# EAGLE design mbV3 (EAGLE 5.10)
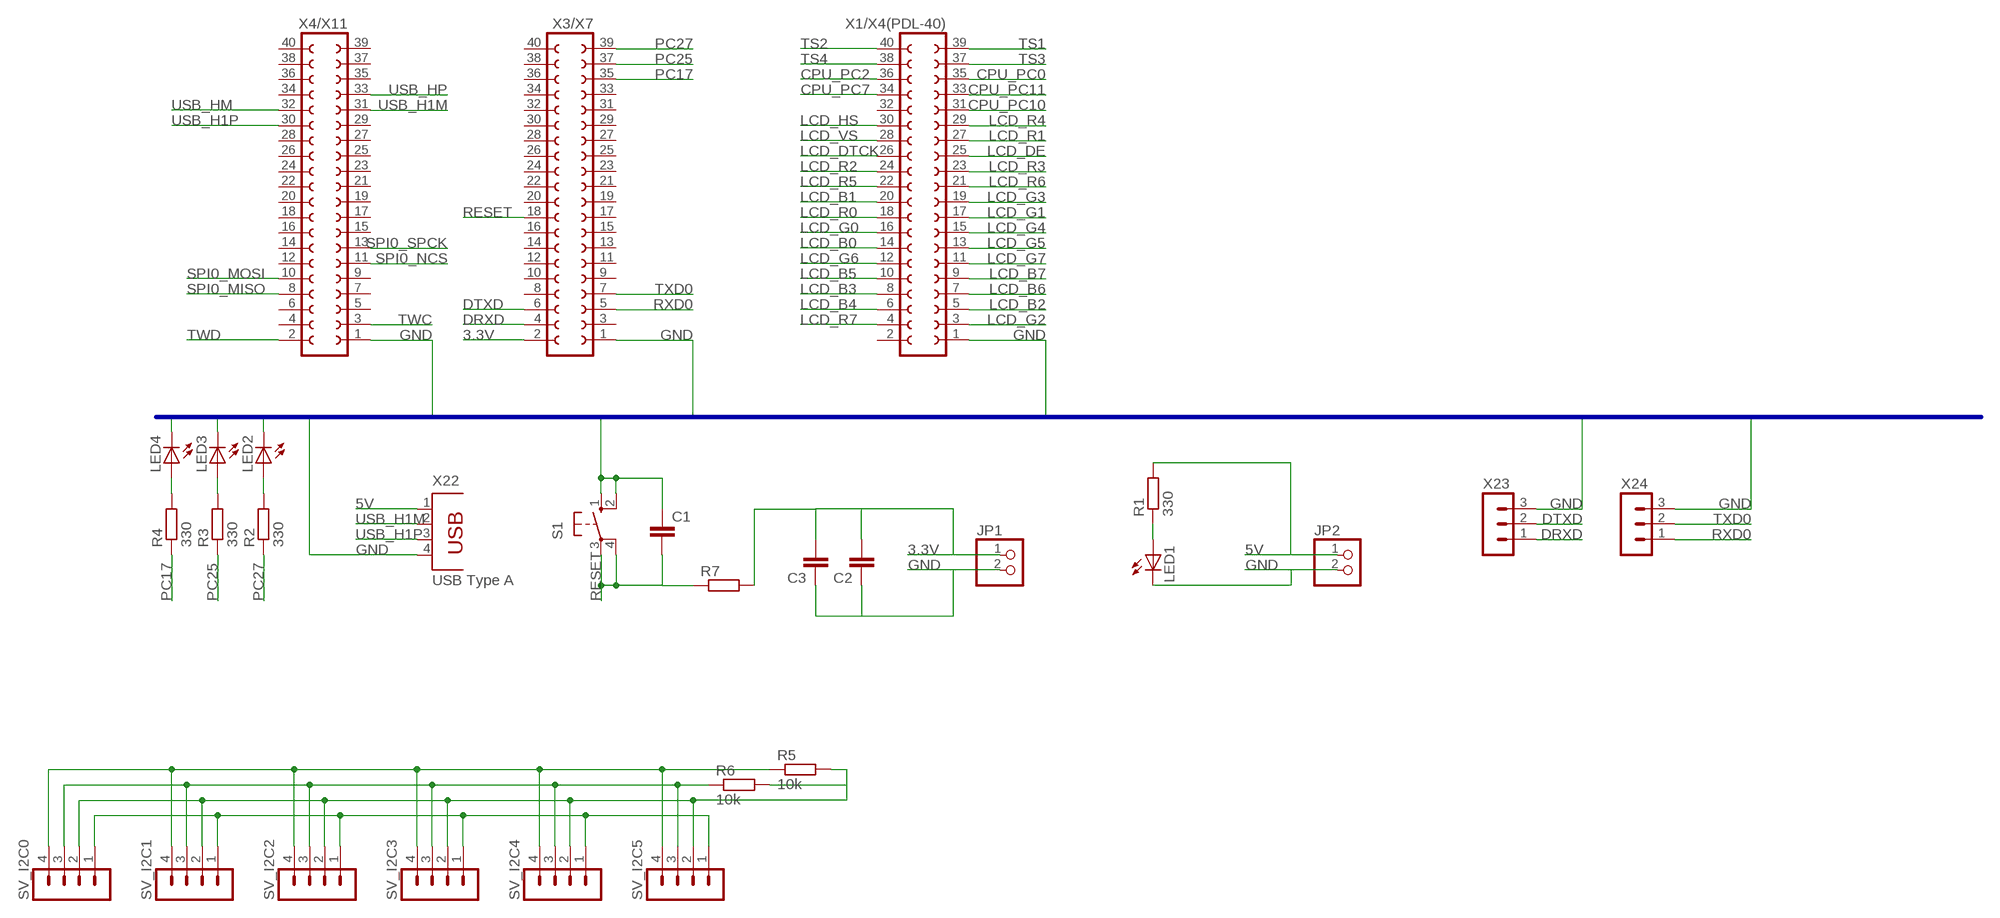
[diagram p0: schematic, sheet 1]

## Parts
C1  C-EUC0805  [C0805]
C2  C-EUC0805  [C0805]
C3  C-EUC0805  [C0805]
JP1  PINHD-1X2  [1X02]
JP2  PINHD-1X2  [1X02]
LED1  LED3MM  [LED3MM]
LED2  LED3MM  [LED3MM]
LED3  LED3MM  [LED3MM]
LED4  LED3MM  [LED3MM]
R1  330  R-EU_M1206  [M1206]
R2  330  R-EU_M1206  [M1206]
R3  330  R-EU_M1206  [M1206]
R4  330  R-EU_M1206  [M1206]
R5  10k  R-EU_R0805  [R0805]
R6  10k  R-EU_R0805  [R0805]
R7  R-EU_R0805  [R0805]
S1  10-XX  [B3F-10XX]
SV_I2C0  MA04-1  [MA04-1]
SV_I2C1  MA04-1  [MA04-1]
SV_I2C2  MA04-1  [MA04-1]
SV_I2C3  MA04-1  [MA04-1]
SV_I2C4  MA04-1  [MA04-1]
SV_I2C5  MA04-1  [MA04-1]
X1/X4(PDL-40)  FE20-2  [FE20-2]
X3/X7  FE20-2  [FE20-2]
X4/X11  FE20-2  [FE20-2]
X22  USB Type A  PN87520  [PN87520]
X23  MA03-1  [MA03-1]
X24  MA03-1  [MA03-1]

## Nets
3.3V: C2.2 C3.2 JP1.1 R5.2 R6.2 R7.2 SV_I2C0.2 SV_I2C1.2 SV_I2C2.2 SV_I2C3.2 SV_I2C4.2 SV_I2C5.2 X3/X7.2
5V: JP2.1 R1.2 X22.1
CPU_PC0: X1/X4(PDL-40).35
CPU_PC2: X1/X4(PDL-40).36
CPU_PC7: X1/X4(PDL-40).34
CPU_PC10: X1/X4(PDL-40).31
CPU_PC11: X1/X4(PDL-40).33
DRXD: X3/X7.4 X23.1
DTXD: X3/X7.6 X23.2
GND: C1.1 C2.1 C3.1 JP1.2 JP2.2 LED1.K(C) LED2.K(C) LED3.K(C) LED4.K(C) S1.1(S) S1.2(S1) SV_I2C0.1 SV_I2C1.1 SV_I2C2.1 SV_I2C3.1 SV_I2C4.1 SV_I2C5.1 X1/X4(PDL-40).1 X3/X7.1 X4/X11.1 X22.4 X23.3 X24.3
LCD_B0: X1/X4(PDL-40).14
LCD_B1: X1/X4(PDL-40).20
LCD_B2: X1/X4(PDL-40).5
LCD_B3: X1/X4(PDL-40).8
LCD_B4: X1/X4(PDL-40).6
LCD_B5: X1/X4(PDL-40).10
LCD_B6: X1/X4(PDL-40).7
LCD_B7: X1/X4(PDL-40).9
LCD_DE: X1/X4(PDL-40).25
LCD_DTCK: X1/X4(PDL-40).26
LCD_G0: X1/X4(PDL-40).16
LCD_G1: X1/X4(PDL-40).17
LCD_G2: X1/X4(PDL-40).3
LCD_G3: X1/X4(PDL-40).19
LCD_G4: X1/X4(PDL-40).15
LCD_G5: X1/X4(PDL-40).13
LCD_G6: X1/X4(PDL-40).12
LCD_G7: X1/X4(PDL-40).11
LCD_HS: X1/X4(PDL-40).30
LCD_R0: X1/X4(PDL-40).18
LCD_R1: X1/X4(PDL-40).27
LCD_R2: X1/X4(PDL-40).24
LCD_R3: X1/X4(PDL-40).23
LCD_R4: X1/X4(PDL-40).29
LCD_R5: X1/X4(PDL-40).22
LCD_R6: X1/X4(PDL-40).21
LCD_R7: X1/X4(PDL-40).4
LCD_VS: X1/X4(PDL-40).28
N$1: LED1.A R1.1
N$4: LED2.A R2.2
N$6: LED3.A R3.2
N$7: LED4.A R4.2
PC17: R4.1 X3/X7.35
PC25: R3.1 X3/X7.37
PC27: R2.1 X3/X7.39
RESET: C1.2 R7.1 S1.3(P) S1.4(P1) X3/X7.18
RXD0: X3/X7.5 X24.1
SPI0_MISO: X4/X11.8
SPI0_MOSI: X4/X11.10
SPI0_NCS: X4/X11.11
SPI0_SPCK: X4/X11.13
TS1: X1/X4(PDL-40).39
TS2: X1/X4(PDL-40).40
TS3: X1/X4(PDL-40).37
TS4: X1/X4(PDL-40).38
TWC: R6.1 SV_I2C0.3 SV_I2C1.3 SV_I2C2.3 SV_I2C3.3 SV_I2C4.3 SV_I2C5.3 X4/X11.3
TWD: R5.1 SV_I2C0.4 SV_I2C1.4 SV_I2C2.4 SV_I2C3.4 SV_I2C4.4 SV_I2C5.4 X4/X11.2
TXD0: X3/X7.7 X24.2
USB_H1M: X4/X11.31 X22.2
USB_H1P: X4/X11.30 X22.3
USB_HM: X4/X11.32
USB_HP: X4/X11.33
Unconnected: X1/X4(PDL-40).2 X1/X4(PDL-40).32 X3/X7.3 X3/X7.8 X3/X7.9 X3/X7.10 X3/X7.11 X3/X7.12 X3/X7.13 X3/X7.14 X3/X7.15 X3/X7.16 X3/X7.17 X3/X7.19 X3/X7.20 X3/X7.21 X3/X7.22 X3/X7.23 X3/X7.24 X3/X7.25 X3/X7.26 X3/X7.27 X3/X7.28 X3/X7.29 X3/X7.30 X3/X7.31 X3/X7.32 X3/X7.33 X3/X7.34 X3/X7.36 X3/X7.38 X3/X7.40 X4/X11.4 X4/X11.5 X4/X11.6 X4/X11.7 X4/X11.9 X4/X11.12 X4/X11.14 X4/X11.15 X4/X11.16 X4/X11.17 X4/X11.18 X4/X11.19 X4/X11.20 X4/X11.21 X4/X11.22 X4/X11.23 X4/X11.24 X4/X11.25 X4/X11.26 X4/X11.27 X4/X11.28 X4/X11.29 X4/X11.34 X4/X11.35 X4/X11.36 X4/X11.37 X4/X11.38 X4/X11.39 X4/X11.40

## Buses
GND

## Library data of the parts
C1-C3 = resistor:C-EU: CAPACITOR, European symbol
JP1 JP2 = pinhead:PINHD-1X2: PIN HEADER
LED1-LED4 = led:LED: LED OSRAM: - CHIPLED LG R971, LG N971, LY N971, LG Q971, LY Q971, LO R971, LY R971 LH N974, LH R974 LS Q976, LO Q976, LY Q976 LO Q996 - Hyper CHIPLED LW Q18S LB Q993, LB Q99A, LB R99A - SideLED LS A670, LO A670, LY A670, LG A670, LP A670 LB A673, LV A673, LT A673, LW A673 LH A674 LY A675 LS A676, LA A676, LO A676, LY A676, LW A676 LS A679, LY A679, LG A679 - Hyper Micro SIDELED® LS Y876, LA Y876, LO Y876, LY Y876 LT Y87S - SmartLED LW L88C, LW L88S LB L89C, LB L89S, LG L890 LS L89K, LO L89K, LY L89K LS L896, LA L896, LO L896, LY L896 - TOPLED LS T670, LO T670, LY T670, LG T670, LP T670 LSG T670, LSP T670, LSY T670, LOP T670, LYG T670 LG T671, LOG T671, LSG T671 LB T673, LV T673, LT T673, LW T673 LH T674 LS T676, LA T676, LO T676, LY T676, LB T676, LH T676, LSB T676, LW T676 LB T67C, LV T67C, LT T67C, LS T67K, LO T67K, LY T67K, LW E67C LS E67B, LA E67B, LO E67B, LY E67B, LB E67C, LV E67C, LT E67C LW T67C LS T679, LY T679, LG T679 LS T770, LO T770, LY T770, LG T770, LP T770 LB T773, LV T773, LT T773, LW T773 LH T774 LS E675, LA E675, LY E675, LS T675 LS T776, LA T776, LO T776, LY T776, LB T776 LHGB T686 LT T68C, LB T68C - Hyper Mini TOPLED® LB M676 - Mini TOPLED Santana® LG M470 LS M47K, LO M47K, LY M47K Source: http://www.osram.convergy.de LUXEON: - LUMILED® LXK2-PW12-R00, LXK2-PW12-S00, LXK2-PW14-U00, LXK2-PW14-V00 LXK2-PM12-R00, LXK2-PM12-S00, LXK2-PM14-U00 LXK2-PE12-Q00, LXK2-PE12-R00, LXK2-PE12-S00, LXK2-PE14-T00, LXK2-PE14-U00 LXK2-PB12-K00, LXK2-PB12-L00, LXK2-PB12-M00, LXK2-PB14-N00, LXK2-PB14-P00, LXK2-PB14-Q00 LXK2-PR12-L00, LXK2-PR12-M00, LXK2-PR14-Q00, LXK2-PR14-R00 LXK2-PD12-Q00, LXK2-PD12-R00, LXK2-PD12-S00 LXK2-PH12-R00, LXK2-PH12-S00 LXK2-PL12-P00, LXK2-PL12-Q00, LXK2-PL12-R00 Source: www.luxeon.com KINGBRIGHT: KA-3528ASYC Source: www.kingbright.com
R1-R7 = resistor:R-EU_: RESISTOR, European symbol
S1 = switch-omron:10-XX: OMRON SWITCH
SV_I2C0 SV_I2C1-SV_I2C5 = con-lstb:MA04-1: PIN HEADER
X1/X4(PDL-40) X3/X7 X4/X11 = con-lsta:FE20-2: FEMALE HEADER
X22 = con-berg:PN87520: BERG USB connector
X23 X24 = con-lstb:MA03-1: PIN HEADER

## Board
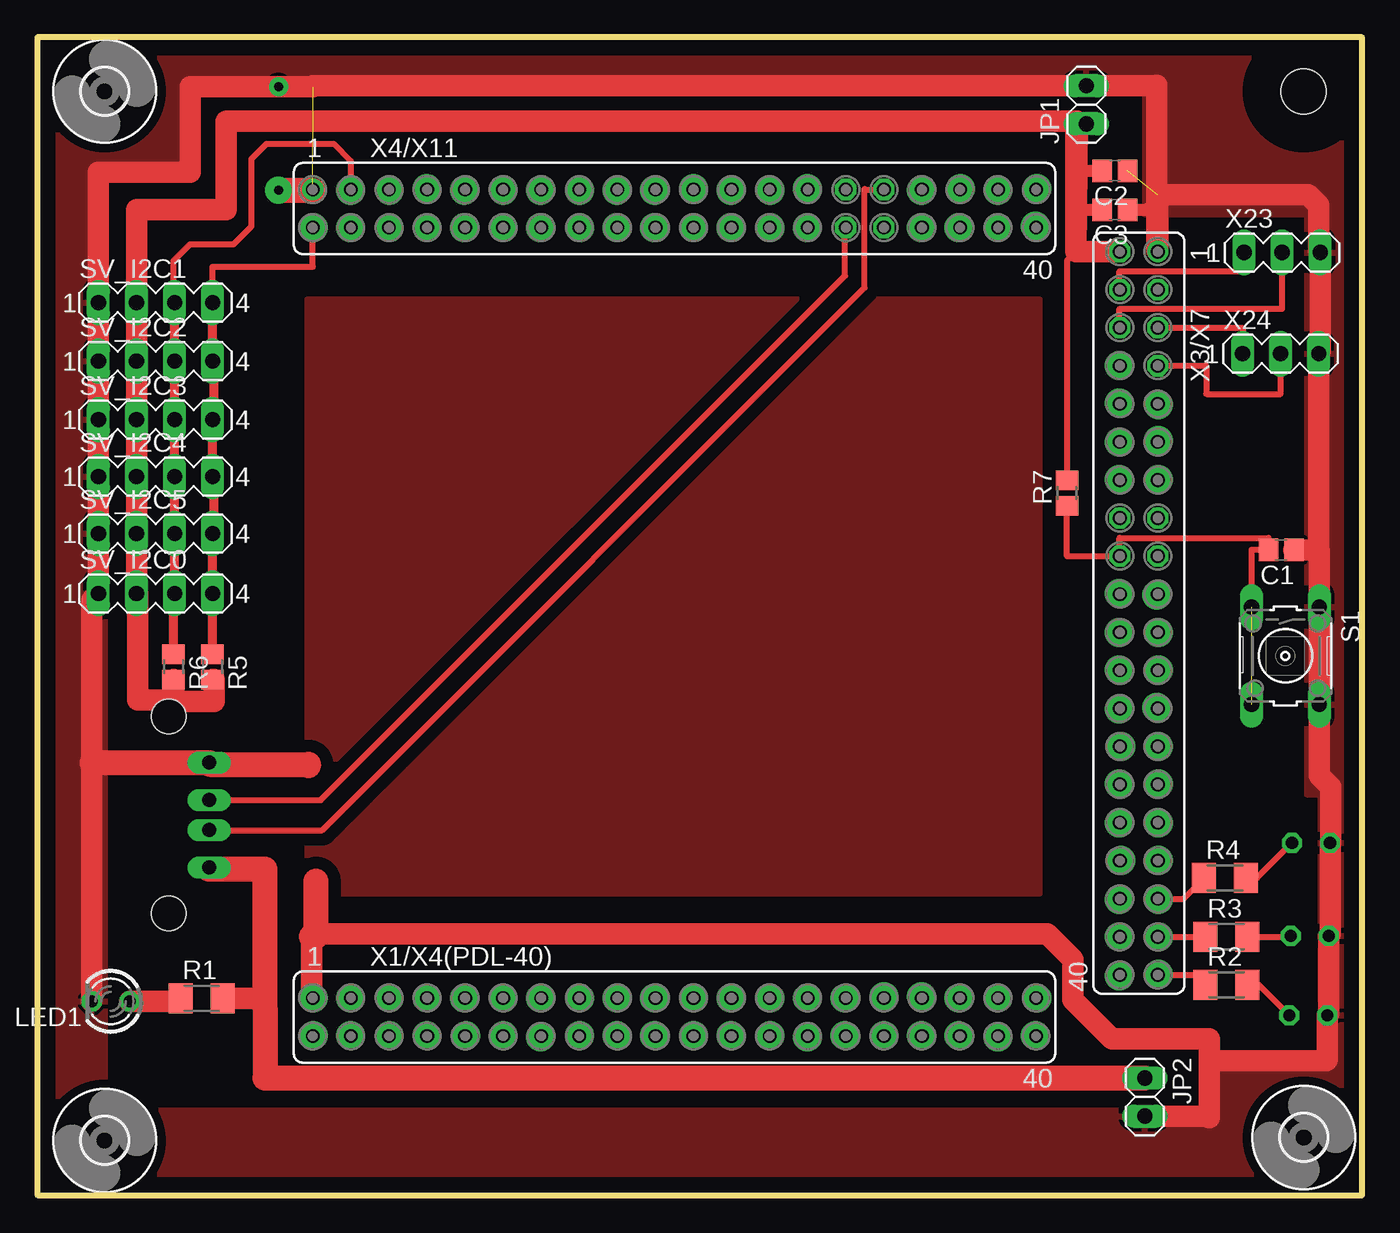
[diagram p1: board, top side]
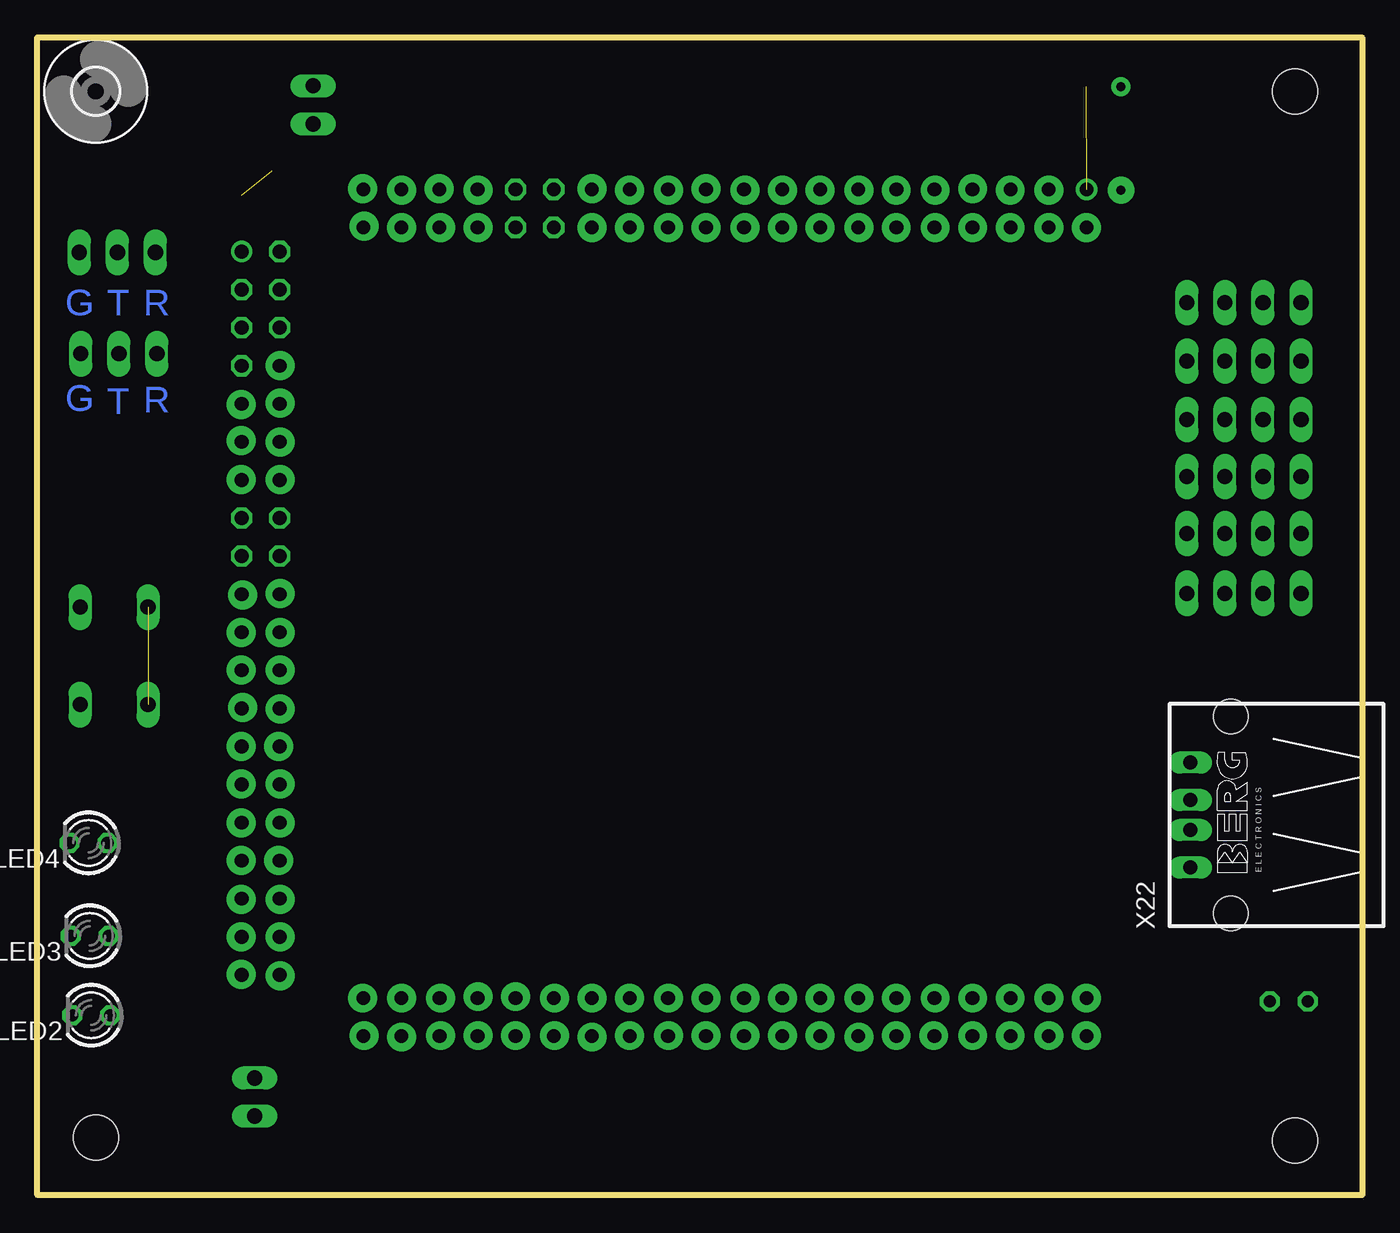
[diagram p2: board, bottom side, seen from below]

Size 88.37 x 77.24 mm. Coordinates in mm from the lower left corner, seen from the top.
Outline: 0,0 88.37,0 88.37,77.24 0,77.24 0,0
Copper layers (1*16): Top 0.035mm / dielectric 1.5mm / Bottom 0.035mm
Design rules "default *": minimum track width 12mil, minimum drill 32mil, track to track 12mil, track to pad 12mil, pad to pad 12mil, via to via 12mil, smd to smd 12mil, copper to edge 40mil, drill to drill 40mil, minimum pad ring 10mil, minimum via ring 8mil, stop-mask expansion 4mil, vias tented up to drill 0mil, thermal gap 10mil

### Footprints (pad centres in the part's own frame; a part is rotated, then mirrored left to right if it is on the bottom)
C0805 = smd 1.3 x 1.5: 1 -0.85,0; 2 0.85,0
1X02 = drill 1.016 long: 1 -1.27,0; 2 1.27,0
LED3MM = drill 0.813 octagon: A -1.27,0; K 1.27,0
M1206 = smd 1.6 x 2: 1 -1.4,0; 2 1.4,0
R0805 = smd 1.3 x 1.5: 1 -0.85,0; 2 0.85,0
B3F-10XX = drill 1.016 long: 1 -3.251,2.261; 2 3.251,2.261; 3 -3.251,-2.261; 4 3.251,-2.261
MA04-1 = drill 1.016 long: 1 -3.81,0; 2 -1.27,0; 3 1.27,0; 4 3.81,0
3,0 = hole 3: 0,0
FE20-2 = drill 0.914 round: 1 -24.13,1.27 | drill 0.914 octagon: 2 -24.13,-1.27; 3 -21.59,1.27; 4 -21.59,-1.27; 5 -19.05,1.27; 6 -19.05,-1.27; 7 -16.51,1.27; 8 -16.51,-1.27; 9 -13.97,1.27; 10 -13.97,-1.27; 11 -11.43,1.27; 12 -11.43,-1.27; 13 -8.89,1.27; 14 -8.89,-1.27; 15 -6.35,1.27; 16 -6.35,-1.27; 17 -3.81,1.27; 18 -3.81,-1.27; 19 -1.27,1.27; 20 -1.27,-1.27; 21 1.27,1.27; 22 1.27,-1.27; 23 3.81,1.27; 24 3.81,-1.27; 25 6.35,1.27; 26 6.35,-1.27; 27 8.89,1.27; 28 8.89,-1.27; 29 11.43,1.27; 30 11.43,-1.27; 31 13.97,1.27; 32 13.97,-1.27; 33 16.51,1.27; 34 16.51,-1.27; 35 19.05,1.27; 36 19.05,-1.27; 37 21.59,1.27; 38 21.59,-1.27; 39 24.13,1.27; 40 24.13,-1.27
PN87520 = drill 0.95 long: 1 -3.5,2.71; 2 -1,2.71; 3 1,2.71; 4 3.5,2.71 | hole 2.3: -6.57,0; 6.57,0
MA03-1 = drill 1.016 long: 1 -2.54,0; 2 0,0; 3 2.54,0

### Placement (x,y rotation side)
C1  82.98,43.05 180 top
C2  71.88,68.35 180 top
C3  71.88,65.75 180 top
JP1  69.98,72.75 90 top
JP2  73.88,6.55 270 top
LED1  4.88,12.93 180 top
LED2  84.78,12 180 bottom
LED3  84.88,17.3 180 bottom
LED4  84.97,23.5 180 bottom
R1  10.95,13.14 0 top
R2  79.33,14.04 0 top
R3  79.33,17.25 0 top
R4  79.23,21.16 0 top
R5  11.68,35.25 270 top
R6  9.08,35.25 270 top
R7  68.68,46.85 90 top
S1  83.25,35.98 270 top
SV_I2C0  7.88,40.15 0 top
SV_I2C1  7.88,59.55 0 top
SV_I2C2  7.88,55.65 0 top
SV_I2C3  7.88,51.75 0 top
SV_I2C4  7.88,47.95 0 top
SV_I2C5  7.88,44.15 0 top
U$1  [3,0]  4.48,3.65 0 top
U$2  [3,0]  84.48,3.85 0 top
U$3  [3,0]  4.48,73.65 0 top
U$4  [3,0]  84.48,73.65 0 bottom
X1/X4(PDL-40)  42.5,11.89 0 top
X3/X7  73.48,38.83 270 top
X4/X11  42.5,65.83 0 top
X22  8.74,25.37 90 bottom
X23  83.04,62.9 0 top
X24  82.94,56.14 0 top

### Tracks (layer width: path | path; a pad name or v marks a point on that pad's centre or on a via)
3.3V
  Top 0.406: R7.2 68.68,62.36 69.28,62.96
  Top 0.813: C2.2 69.45,68.35 69.34,68.46 | C3.2 69.32,65.75 69.31,65.76
  Top 1.422: JP1.1 69.28,71.48 69.28,62.96 | 69.28,62.96 69.28,62.95 X3/X7.2 69.28,62.96 | 69.28,62.96 69.31,65.76 69.34,68.46 69.38,71.65 12.58,71.65 12.58,65.75 6.61,65.75 SV_I2C1.2 SV_I2C2.2 SV_I2C3.2 SV_I2C4.2 SV_I2C5.2 SV_I2C0.2 6.68,40.15 6.68,33.05 9.08,33.05 | 9.08,33.05 R6.2 | R5.2 11.78,34.4 11.78,32.95 9.08,32.95 9.08,33.05
5V
  Top 1.422: 11.46,21.75 X22.1 | R1.2 14.58,13.14 15.18,12.55
  Top 1.676: JP2.1 15.18,7.82 15.18,12.55 15.18,21.75 11.46,21.75
DRXD
  Top 0.406: X3/X7.4 72.18,60.42 72.18,61.65 80.5,61.65 X23.1
DTXD
  Top 0.406: X3/X7.6 72.18,57.88 72.18,59.15 83.04,59.15 X23.2
GND  (2 unrouted)
  Top 0.813: C3.1 73.98,65.75 74.08,65.85
  Top 1.422: 18.37,74.02 JP1.2 74.65,74.02 74.68,74.05 74.68,63.03 X3/X7.1 74.75,66.72 74.78,66.75 84.78,66.75 85.48,66.05 85.48,63 X23.3 85.58,56.24 X24.3 85.48,43.05 | X4/X11.1 | 18.38,73.95 10.18,73.95 10.18,68.25 4.07,68.25 SV_I2C1.1 SV_I2C2.1 SV_I2C3.1 SV_I2C4.1 SV_I2C5.1 SV_I2C0.1 3.61,39.7 3.61,28.85 | 85.48,43.05 C1.1 | 85.48,43.05 85.52,43.01 S1.1 S1.2 85.52,28.01 86.28,27.25 86.28,23.55 LED4.K 86.23,17.39 LED3.K 86.15,12.09 LED2.K 86.06,9.03 85.98,8.95 78.18,8.95 | JP2.2 78.05,5.28 78.18,5.15 78.18,8.95 | 78.18,8.95 78.18,10.45 71.68,10.45 69.08,13.05 69.08,15.75 67.38,17.45 18.38,17.45 18.28,17.35 18.28,17.25 18.28,13.25 X1/X4(PDL-40).1 | LED1.K 3.61,28.85 | 3.61,28.85 3.63,28.87
  Top 1.676: 3.63,28.87 X22.4 | 18.28,17.25 18.58,17.25 18.58,20.95
  pour Top: 0.28,77.05 4.48,77.05 4.48,-0.05 0.28,-0.05
  pour Top: 0.28,77.05 0.28,69.15 9.48,69.15 9.48,73.55 88.28,73.55 88.28,77.15 0.28,77.15
  pour Top: 88.28,77.15 73.88,77.15 73.88,65.45 84.68,65.45 84.68,26.75 85.58,26.75 85.58,-0.05 88.28,-0.05
  pour Top: 88.38,0.35 4.58,0.35 4.58,5.65 88.38,5.65
  pour Top: 78.68,9.05 88.38,9.05 88.38,-0.05 78.68,-0.05
GND1
  pour Top (isolate 0.813): 17.98,20.15 66.88,20.15 66.88,59.75 17.98,59.75
N$1
  Top 1.422: LED1.A 9.34,12.93 R1.1
N$2  (via drill 0.6 pad 1.78)
  Top 1.676: v16.08,67.05 18.38,67.05
N$3  (via drill 0.6 pad 1.93)
  other vias: 18.38,64.55
N$4
  Top 0.406: R2.2 81.48,14.04 LED2.A
N$5  (via drill 0.6 pad 1.27)
  other vias: 16.08,73.95
N$6
  Top 0.406: R3.2 83.56,17.25 LED3.A
N$7
  Top 0.406: R4.2 81.35,21.16 LED4.A
N$8  (via drill 0.6 pad 1.93)
  other vias: 20.88,64.55
N$9
  Top 1.676: 11.48,28.75 18.08,28.75 18.08,28.65
N$10  (via drill 0.6 pad 1.93)
  other vias: 23.48,64.55
N$11  (via drill 0.6 pad 1.93)
  other vias: 25.98,64.55
N$12  (via drill 0.6 pad 1.93)
  other vias: 20.88,67.05
N$13  (via drill 0.6 pad 1.93)
  other vias: 23.48,67.05
N$14  (via drill 0.6 pad 1.93)
  other vias: 25.98,67.15
N$15  (via drill 0.6 pad 1.93)
  other vias: 28.48,67.05
N$16  (via drill 0.6 pad 1.93)
  other vias: 28.48,64.55
N$17  (via drill 0.6 pad 1.93)
  other vias: 31.08,64.55
N$18  (via drill 0.6 pad 1.93)
  other vias: 31.08,67.05
N$19  (via drill 0.6 pad 1.93)
  other vias: 33.58,67.05
N$20  (via drill 0.6 pad 1.93)
  other vias: 33.58,64.55
N$21  (via drill 0.6 pad 1.93)
  other vias: 36.18,64.55
N$22  (via drill 0.6 pad 1.93)
  other vias: 36.18,67.05
N$23  (via drill 0.6 pad 1.93)
  other vias: 38.68,64.55
N$24  (via drill 0.6 pad 1.93)
  other vias: 38.68,67.05
N$25  (via drill 0.6 pad 1.93)
  other vias: 41.18,67.05
N$26  (via drill 0.6 pad 1.93)
  other vias: 41.18,64.55
N$27  (via drill 0.6 pad 1.93)
  other vias: 43.78,67.15
N$28  (via drill 0.6 pad 1.93)
  other vias: 43.78,64.55
N$29  (via drill 0.6 pad 1.93)
  other vias: 46.28,64.55
N$30  (via drill 0.6 pad 1.93)
  other vias: 46.28,67.05
N$31  (via drill 0.6 pad 1.93)
  other vias: 48.88,67.05
N$32  (via drill 0.6 pad 1.93)
  other vias: 48.88,64.55
N$33  (via drill 0.6 pad 1.93)
  other vias: 51.38,64.55
N$34  (via drill 0.6 pad 1.93)
  other vias: 51.38,67.15
N$35  (via drill 0.6 pad 1.93)
  other vias: 58.98,67.05
N$36  (via drill 0.6 pad 1.93)
  other vias: 58.98,64.55
N$37  (via drill 0.6 pad 1.93)
  other vias: 61.58,67.15
N$38  (via drill 0.6 pad 1.93)
  other vias: 61.48,64.55
N$39  (via drill 0.6 pad 1.93)
  other vias: 64.08,64.55
N$40  (via drill 0.6 pad 1.93)
  other vias: 64.08,67.05
N$41  (via drill 0.6 pad 1.93)
  other vias: 66.68,67.15
N$42  (via drill 0.6 pad 1.93)
  other vias: 66.58,64.65
N$43  (via drill 0.6 pad 1.93)
  other vias: 72.18,55.35
N$44  (via drill 0.6 pad 1.93)
  other vias: 72.18,52.85
N$45  (via drill 0.6 pad 1.93)
  other vias: 74.78,52.75
N$46  (via drill 0.6 pad 1.93)
  other vias: 74.78,50.35
N$47  (via drill 0.6 pad 1.93)
  other vias: 72.18,50.25
N$48  (via drill 0.6 pad 1.93)
  other vias: 72.18,47.75
N$49  (via drill 0.6 pad 1.93)
  other vias: 74.78,47.75
N$50  (via drill 0.6 pad 1.93)
  other vias: 74.68,40.05
N$51  (via drill 0.6 pad 1.93)
  other vias: 72.18,40.15
N$52  (via drill 0.6 pad 1.93)
  other vias: 72.18,37.55
N$53  (via drill 0.6 pad 1.93)
  other vias: 74.78,37.55
N$54  (via drill 0.6 pad 1.93)
  other vias: 72.18,35.05
N$55  (via drill 0.6 pad 1.93)
  other vias: 74.78,35.05
N$56  (via drill 0.6 pad 1.93)
  other vias: 72.18,32.45
N$57  (via drill 0.6 pad 1.93)
  other vias: 74.68,32.55
N$58  (via drill 0.6 pad 1.93)
  other vias: 74.78,29.95
N$59  (via drill 0.6 pad 1.93)
  other vias: 72.28,29.95
N$60  (via drill 0.6 pad 1.93)
  other vias: 72.18,27.45
N$61  (via drill 0.6 pad 1.93)
  other vias: 74.78,27.45
N$62  (via drill 0.6 pad 1.93)
  other vias: 74.78,24.85
N$63  (via drill 0.6 pad 1.93)
  other vias: 72.18,24.85
N$64  (via drill 0.6 pad 1.93)
  other vias: 74.78,22.35
N$65  (via drill 0.6 pad 1.93)
  other vias: 72.28,22.35
N$66  (via drill 0.6 pad 1.93)
  other vias: 72.18,19.75
N$67  (via drill 0.6 pad 1.93)
  other vias: 74.78,19.75
N$68  (via drill 0.6 pad 1.93)
  other vias: 72.18,17.25
N$69  (via drill 0.6 pad 1.93)
  other vias: 74.78,17.25
N$70  (via drill 0.6 pad 1.93)
  other vias: 72.18,14.65
N$71  (via drill 0.6 pad 1.93)
  other vias: 74.78,14.75
N$72  (via drill 0.6 pad 1.93)
  other vias: 66.68,13.15
N$73  (via drill 0.6 pad 1.93)
  other vias: 66.58,10.65
N$74  (via drill 0.6 pad 1.93)
  other vias: 64.08,10.55
N$75  (via drill 0.6 pad 1.93)
  other vias: 64.08,13.15
N$76  (via drill 0.6 pad 1.93)
  other vias: 61.48,10.65
N$77  (via drill 0.6 pad 1.93)
  other vias: 61.48,13.15
N$78  (via drill 0.6 pad 1.93)
  other vias: 58.98,13.25
N$79  (via drill 0.6 pad 1.93)
  other vias: 58.98,10.65
N$80  (via drill 0.6 pad 1.93)
  other vias: 56.48,13.25
N$81  (via drill 0.6 pad 1.93)
  other vias: 56.48,10.65
N$82  (via drill 0.6 pad 1.93)
  other vias: 53.88,10.65
N$83  (via drill 0.6 pad 1.93)
  other vias: 53.88,13.15
N$84  (via drill 0.6 pad 1.93)
  other vias: 51.38,13.15
N$85  (via drill 0.6 pad 1.93)
  other vias: 51.38,10.55
N$86  (via drill 0.6 pad 1.93)
  other vias: 48.88,13.15
N$87  (via drill 0.6 pad 1.93)
  other vias: 48.88,10.65
N$88  (via drill 0.6 pad 1.93)
  other vias: 46.28,10.65
N$89  (via drill 0.6 pad 1.93)
  other vias: 46.28,13.15
N$90  (via drill 0.6 pad 1.93)
  other vias: 43.78,13.15
N$91  (via drill 0.6 pad 1.93)
  other vias: 43.78,10.65
N$92  (via drill 0.6 pad 1.93)
  other vias: 41.18,13.15
N$93  (via drill 0.6 pad 1.93)
  other vias: 41.18,10.65
N$94  (via drill 0.6 pad 1.93)
  other vias: 38.68,10.65
N$95  (via drill 0.6 pad 1.93)
  other vias: 38.68,13.15
N$96  (via drill 0.6 pad 1.93)
  other vias: 36.18,13.15
N$97  (via drill 0.6 pad 1.93)
  other vias: 36.18,10.65
N$98  (via drill 0.6 pad 1.93)
  other vias: 33.58,13.15
N$99  (via drill 0.6 pad 1.93)
  other vias: 33.58,10.55
N$100  (via drill 0.6 pad 1.93)
  other vias: 31.08,13.15
N$101  (via drill 0.6 pad 1.93)
  other vias: 31.08,10.65
N$102  (via drill 0.6 pad 1.93)
  other vias: 28.48,13.15
N$103  (via drill 0.6 pad 1.93)
  other vias: 28.58,10.65
N$104  (via drill 0.6 pad 1.93)
  other vias: 25.98,10.65
N$105  (via drill 0.6 pad 1.93)
  other vias: 25.98,13.15
N$106  (via drill 0.6 pad 1.93)
  other vias: 23.48,13.15
N$107  (via drill 0.6 pad 1.93)
  other vias: 23.48,10.65
N$108  (via drill 0.6 pad 1.93)
  other vias: 18.38,13.15
N$109  (via drill 0.6 pad 1.93)
  other vias: 18.38,10.65
N$110  (via drill 0.6 pad 1.93)
  other vias: 20.88,13.15
N$111  (via drill 0.6 pad 1.93)
  other vias: 20.88,10.65
N$112  (via drill 0.6 pad 1.93)
  other vias: 4.48,73.65
N$113  (via drill 0.6 pad 1.93)
  other vias: 84.48,73.65
N$114  (via drill 0.6 pad 1.93)
  other vias: 84.48,3.85
N$115  (via drill 0.6 pad 1.93)
  other vias: 4.48,3.65
PC17
  Top 0.406: X3/X7.35 76.45,19.78 R4.1
PC25
  Top 0.406: X3/X7.37 77.92,17.24 R3.1
PC27
  Top 0.406: X3/X7.39 77.27,14.7 R2.1
RESET  (1 unrouted)
  Top 0.406: 72.18,42.64 X3/X7.18 | 72.18,42.64 72.18,43.85 82.13,43.85 C1.2 80.99,43.05 S1.3 | 72.18,42.64 68.68,42.64 R7.1
RXD0
  Top 0.406: X3/X7.5 80.4,57.88 X24.1
TWC
  Top 0.406: X4/X11.3 20.91,69.02 19.78,70.15 15.28,70.15 14.28,69.15 14.28,64.65 13.08,63.45 10.18,63.45 9.08,62.35 9.08,59.62 SV_I2C1.3
  Top 0.61: SV_I2C1.3 SV_I2C2.3 SV_I2C3.3 SV_I2C4.3 SV_I2C5.3 SV_I2C0.3 9.08,40.08 R6.1
  Top 1.422: SV_I2C0.3 9.08,40.15
TWD
  Top 0.406: X4/X11.2 18.37,61.96 18.38,61.95 11.68,61.95 SV_I2C1.4
  Top 0.61: SV_I2C1.4 SV_I2C2.4 11.78,55.56 11.78,51.65 SV_I2C3.4 SV_I2C4.4 11.78,47.86 11.78,44.15 SV_I2C5.4 SV_I2C0.4 R5.1
  Top 1.422: SV_I2C0.4
TXD0
  Top 0.406: X3/X7.7 77.98,55.34 77.98,53.45 82.94,53.45 X24.2
USB_H1M
  Top 0.406: X4/X11.31 55.23,67.1 55.18,67.15 55.18,60.55 18.98,24.35 11.47,24.35 X22.2
USB_H1P
  Top 0.406: X22.3 18.9,26.37 53.88,61.35 53.88,64.51 X4/X11.30

### Text on the board
Bottom: R | T | G | R | T | G